# Altium schematic sheet SDCARD.schdoc
size 54 x 50 mm
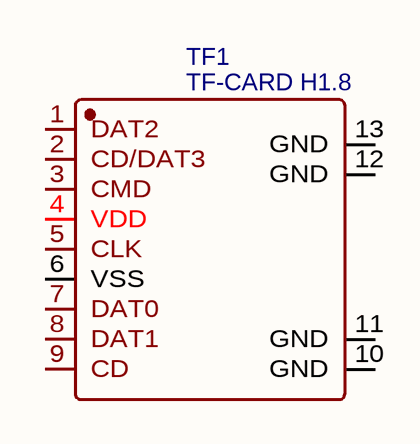
[diagram p0: SDCARD.schdoc]

## Parts
TF1  TF-CARD H1.8  [TF-SMD_TF-CARD-H1.8]

## Nets

Not connected (* = marked no-connect by the designer): TF1 1(DAT2) 2(CD/DAT3) 3(CMD) 4(VDD) 5(CLK) 6(VSS) 7(DAT0) 8(DAT1) 9(CD) 10(GND) 11(GND) 12(GND) 13(GND)

## Library data of the parts
TF1 = TF-CARD H1.8: Manufacturer: SHOU HAN(首韩); Contributor: lcsc; Supplier: LCSC; Supplier Part: C7529389; Manufacturer Part: TF-CARD H1.8; JLCPCB Part Class: Extended Part; spicePre: T; spiceSymbolName: TF-CARD H1.8